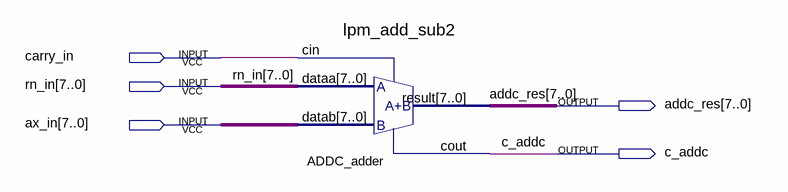
[diagram p0: schematic sheet]
// Quartus schematic alu_addc.bdf as structural Verilog: 1 symbols, 5 pins
module alu_addc (
  input  carry_in,
  input  [7:0] rn_in,
  input  [7:0] ax_in,
  output [7:0] addc_res,
  output c_addc
);

  lpm_add_sub2 ADDC_adder (.dataa(rn_in), .datab(ax_in), .cin(carry_in), .result(addc_res), .cout(c_addc));
endmodule
